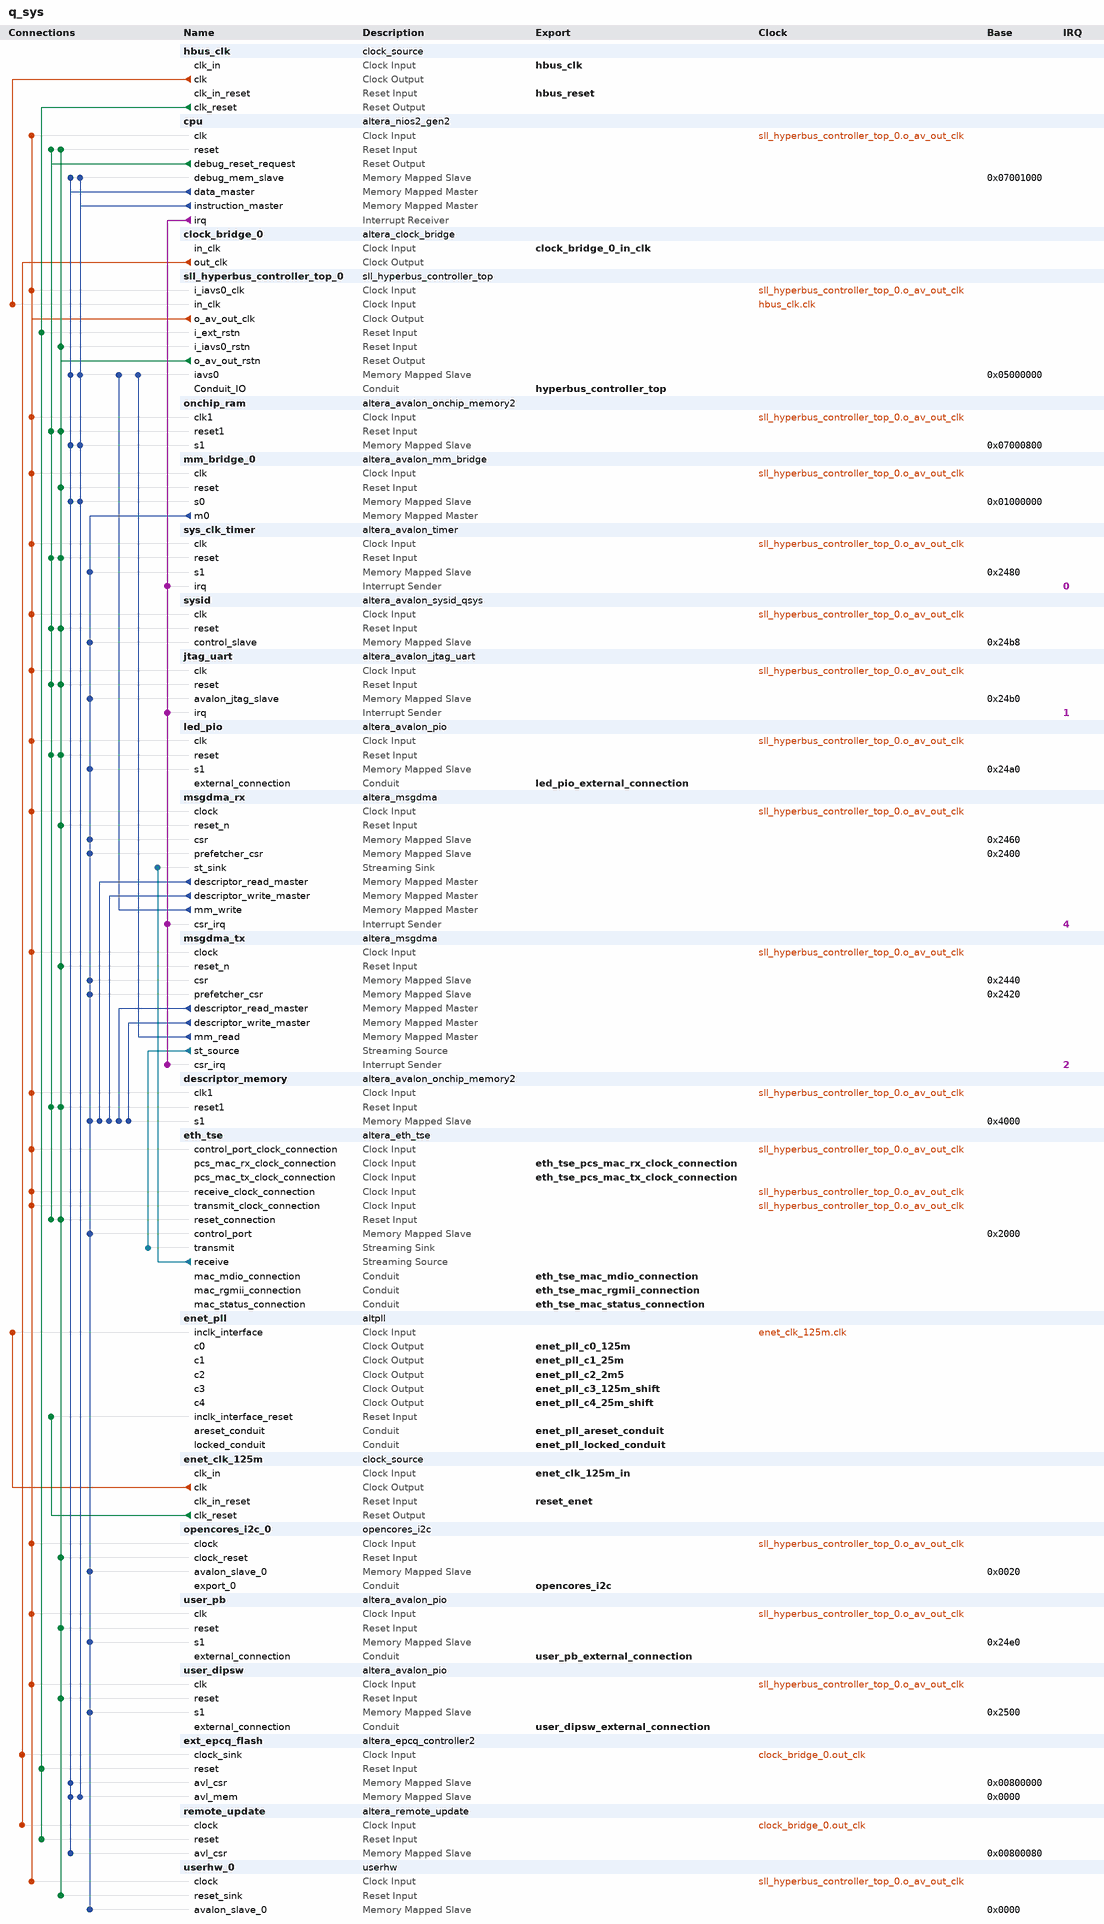
[diagram p0: system contents]
# Platform Designer (Qsys) system q_sys, Cyclone 10 LP 10CL025YU256I7G
# Parameters at their usual value, and those the tool derives, are not listed.
package require -exact qsys 18.1
create_system q_sys
set_project_property DEVICE_FAMILY {Cyclone 10 LP}
set_project_property DEVICE 10CL025YU256I7G

add_instance hbus_clk clock_source 18.1
set_instance_parameter_value hbus_clk clockFrequency 50000000

add_instance cpu altera_nios2_gen2 18.1
set_instance_parameter_value cpu dcache_bursts true
set_instance_parameter_value cpu dcache_size 4096
set_instance_parameter_value cpu exceptionOffset 288
set_instance_parameter_value cpu exceptionSlave sll_hyperbus_controller_top_0.iavs0
set_instance_parameter_value cpu icache_burstType Sequential
set_instance_parameter_value cpu icache_size 4096
set_instance_parameter_value cpu impl Fast
set_instance_parameter_value cpu mul_32_impl 3
set_instance_parameter_value cpu resetOffset 3145728
set_instance_parameter_value cpu resetSlave ext_epcq_flash.avl_mem
set_instance_parameter_value cpu setting_activateTrace true
set_instance_parameter_value cpu shift_rot_impl 0

add_instance clock_bridge_0 altera_clock_bridge 18.1
set_instance_parameter_value clock_bridge_0 DERIVED_CLOCK_RATE 0
set_instance_parameter_value clock_bridge_0 EXPLICIT_CLOCK_RATE 0

add_instance sll_hyperbus_controller_top_0 sll_hyperbus_controller_top 3.1.0
set_instance_parameter_value sll_hyperbus_controller_top_0 GUI_DEV0_BURST_LENGTH_MAN 3
set_instance_parameter_value sll_hyperbus_controller_top_0 GUI_DEV0_DRIVE_STRENGTH_MAN 0
set_instance_parameter_value sll_hyperbus_controller_top_0 GUI_DEV0_FIXED_LATENCY_MAN 1
set_instance_parameter_value sll_hyperbus_controller_top_0 GUI_DEV0_INIT_LATENCY_MAN 6
set_instance_parameter_value sll_hyperbus_controller_top_0 GUI_DEV0_TYPE_MAN none
set_instance_parameter_value sll_hyperbus_controller_top_0 GUI_DEV0_USE_DEFAULT true
set_instance_parameter_value sll_hyperbus_controller_top_0 GUI_DEV1_BURST_LENGTH_MAN 3
set_instance_parameter_value sll_hyperbus_controller_top_0 GUI_DEV1_DRIVE_STRENGTH_MAN 0
set_instance_parameter_value sll_hyperbus_controller_top_0 GUI_DEV1_FIXED_LATENCY_MAN 1
set_instance_parameter_value sll_hyperbus_controller_top_0 GUI_DEV1_INIT_LATENCY_MAN 6
set_instance_parameter_value sll_hyperbus_controller_top_0 GUI_DEV1_TYPE_MAN none
set_instance_parameter_value sll_hyperbus_controller_top_0 GUI_DEV1_USE_DEFAULT true
set_instance_parameter_value sll_hyperbus_controller_top_0 GUI_DQIN_MODE 8
set_instance_parameter_value sll_hyperbus_controller_top_0 GUI_DUAL_RWDS_PIN false
set_instance_parameter_value sll_hyperbus_controller_top_0 GUI_FPGA_DEV_BOARD alt_c10_dev2
set_instance_parameter_value sll_hyperbus_controller_top_0 GUI_IAVS0_ADDR_UNITS Words
set_instance_parameter_value sll_hyperbus_controller_top_0 GUI_IAVS0_BURST_ON_BURST_BOUNDARIES_ONLY false
set_instance_parameter_value sll_hyperbus_controller_top_0 GUI_IAVS0_BYTEENABLE true
set_instance_parameter_value sll_hyperbus_controller_top_0 GUI_IAVS0_DATA_WIDTH 32
set_instance_parameter_value sll_hyperbus_controller_top_0 GUI_IAVS0_LINEWRAP_BURST true
set_instance_parameter_value sll_hyperbus_controller_top_0 GUI_IAVS0_MAX_BURST_IN_WORDS 8
set_instance_parameter_value sll_hyperbus_controller_top_0 GUI_IAVS0_REG_RDATA false
set_instance_parameter_value sll_hyperbus_controller_top_0 GUI_IAVS0_REG_WDATA false
set_instance_parameter_value sll_hyperbus_controller_top_0 GUI_IAVS0_USE_RESPONSE false
set_instance_parameter_value sll_hyperbus_controller_top_0 GUI_IAVS0_WRITE_MODE true
set_instance_parameter_value sll_hyperbus_controller_top_0 GUI_INCLUDE_REG_AVALON 0
set_instance_parameter_value sll_hyperbus_controller_top_0 GUI_INPUT_FREQ_IN_MHZ_SC 50
set_instance_parameter_value sll_hyperbus_controller_top_0 GUI_INTEGRATED_PLL_ENABLED 1
set_instance_parameter_value sll_hyperbus_controller_top_0 GUI_SINGLE_CLK_OP false
set_instance_parameter_value sll_hyperbus_controller_top_0 HYPERBUS_FREQ_IN_MHZ 150
set_instance_parameter_value sll_hyperbus_controller_top_0 IAVS_FREQ_OUT_IN_MHZ 75
set_instance_parameter_value sll_hyperbus_controller_top_0 NUM_CHIPSELECTS 2

add_instance onchip_ram altera_avalon_onchip_memory2 18.1
set_instance_parameter_value onchip_ram dataWidth 32
set_instance_parameter_value onchip_ram dualPort false
set_instance_parameter_value onchip_ram initMemContent true
set_instance_parameter_value onchip_ram initializationFileName onchip_mem.hex
set_instance_parameter_value onchip_ram memorySize 2048

add_instance mm_bridge_0 altera_avalon_mm_bridge 18.1
set_instance_parameter_value mm_bridge_0 ADDRESS_UNITS SYMBOLS
set_instance_parameter_value mm_bridge_0 ADDRESS_WIDTH 10
set_instance_parameter_value mm_bridge_0 DATA_WIDTH 32
set_instance_parameter_value mm_bridge_0 MAX_PENDING_RESPONSES 4
set_instance_parameter_value mm_bridge_0 USE_AUTO_ADDRESS_WIDTH 1

add_instance sys_clk_timer altera_avalon_timer 18.1
set_instance_parameter_value sys_clk_timer period 10
set_instance_parameter_value sys_clk_timer periodUnits MSEC

add_instance sysid altera_avalon_sysid_qsys 18.1
set_instance_parameter_value sysid id -87110914

add_instance jtag_uart altera_avalon_jtag_uart 18.1
set_instance_parameter_value jtag_uart simInteractiveOptions INTERACTIVE_ASCII_OUTPUT

add_instance led_pio altera_avalon_pio 18.1
set_instance_parameter_value led_pio direction Output
set_instance_parameter_value led_pio resetValue 15
set_instance_parameter_value led_pio width 4

add_instance msgdma_rx altera_msgdma 18.1
set_instance_parameter_value msgdma_rx BURST_ENABLE 0
set_instance_parameter_value msgdma_rx DATA_FIFO_DEPTH 64
set_instance_parameter_value msgdma_rx DATA_WIDTH 32
set_instance_parameter_value msgdma_rx DESCRIPTOR_FIFO_DEPTH 128
set_instance_parameter_value msgdma_rx ENHANCED_FEATURES 0
set_instance_parameter_value msgdma_rx ERROR_ENABLE 1
set_instance_parameter_value msgdma_rx ERROR_WIDTH 6
set_instance_parameter_value msgdma_rx MAX_BURST_COUNT 8
set_instance_parameter_value msgdma_rx MAX_BYTE 524288
set_instance_parameter_value msgdma_rx MODE 2
set_instance_parameter_value msgdma_rx PACKET_ENABLE 1
set_instance_parameter_value msgdma_rx PREFETCHER_ENABLE 1
set_instance_parameter_value msgdma_rx TRANSFER_TYPE {Aligned Accesses}

add_instance msgdma_tx altera_msgdma 18.1
set_instance_parameter_value msgdma_tx BURST_ENABLE 0
set_instance_parameter_value msgdma_tx DATA_FIFO_DEPTH 128
set_instance_parameter_value msgdma_tx DATA_WIDTH 32
set_instance_parameter_value msgdma_tx DESCRIPTOR_FIFO_DEPTH 128
set_instance_parameter_value msgdma_tx ENHANCED_FEATURES 0
set_instance_parameter_value msgdma_tx ERROR_ENABLE 1
set_instance_parameter_value msgdma_tx ERROR_WIDTH 1
set_instance_parameter_value msgdma_tx MAX_BURST_COUNT 8
set_instance_parameter_value msgdma_tx MAX_BYTE 262144
set_instance_parameter_value msgdma_tx MODE 1
set_instance_parameter_value msgdma_tx PACKET_ENABLE 1
set_instance_parameter_value msgdma_tx PREFETCHER_ENABLE 1
set_instance_parameter_value msgdma_tx TRANSFER_TYPE {Aligned Accesses}

add_instance descriptor_memory altera_avalon_onchip_memory2 18.1
set_instance_parameter_value descriptor_memory dataWidth 32
set_instance_parameter_value descriptor_memory dualPort false
set_instance_parameter_value descriptor_memory initMemContent true
set_instance_parameter_value descriptor_memory initializationFileName descriptor_memory
set_instance_parameter_value descriptor_memory memorySize 8192

add_instance eth_tse altera_eth_tse 18.1
set_instance_parameter_value eth_tse XCVR_RCFG_JTAG_ENABLE 0
set_instance_parameter_value eth_tse XCVR_SET_CAPABILITY_REG_ENABLE 0
set_instance_parameter_value eth_tse XCVR_SET_CSR_SOFT_LOGIC_ENABLE 0
set_instance_parameter_value eth_tse XCVR_SET_PRBS_SOFT_LOGIC_ENABLE 0
set_instance_parameter_value eth_tse XCVR_SET_USER_IDENTIFIER 0
set_instance_parameter_value eth_tse core_variation MAC_ONLY
set_instance_parameter_value eth_tse eg_addr 9
set_instance_parameter_value eth_tse enable_hd_logic false
set_instance_parameter_value eth_tse enable_mac_flow_ctrl false
set_instance_parameter_value eth_tse enable_magic_detect true
set_instance_parameter_value eth_tse enable_sgmii true
set_instance_parameter_value eth_tse enable_shift16 true
set_instance_parameter_value eth_tse ifGMII RGMII
set_instance_parameter_value eth_tse ing_addr 10
set_instance_parameter_value eth_tse mdio_clk_div 40
set_instance_parameter_value eth_tse nf_phyip_rcfg_enable true
set_instance_parameter_value eth_tse stat_cnt_ena true
set_instance_parameter_value eth_tse transceiver_type NONE

add_instance enet_pll altpll 18.1
set_instance_parameter_value enet_pll CLK0_DIVIDE_BY 1
set_instance_parameter_value enet_pll CLK0_MULTIPLY_BY 1
set_instance_parameter_value enet_pll CLK1_DIVIDE_BY 5
set_instance_parameter_value enet_pll CLK1_DUTY_CYCLE 50
set_instance_parameter_value enet_pll CLK1_MULTIPLY_BY 1
set_instance_parameter_value enet_pll CLK1_PHASE_SHIFT 0
set_instance_parameter_value enet_pll CLK2_DIVIDE_BY 50
set_instance_parameter_value enet_pll CLK2_DUTY_CYCLE 50
set_instance_parameter_value enet_pll CLK2_MULTIPLY_BY 1
set_instance_parameter_value enet_pll CLK2_PHASE_SHIFT 0
set_instance_parameter_value enet_pll CLK3_DIVIDE_BY 1
set_instance_parameter_value enet_pll CLK3_DUTY_CYCLE 50
set_instance_parameter_value enet_pll CLK3_MULTIPLY_BY 1
set_instance_parameter_value enet_pll CLK3_PHASE_SHIFT 2000
set_instance_parameter_value enet_pll CLK4_DIVIDE_BY 5
set_instance_parameter_value enet_pll CLK4_DUTY_CYCLE 50
set_instance_parameter_value enet_pll CLK4_MULTIPLY_BY 1
set_instance_parameter_value enet_pll CLK4_PHASE_SHIFT 10000
set_instance_parameter_value enet_pll INCLK0_INPUT_FREQUENCY 8000
set_instance_parameter_value enet_pll PORT_ARESET PORT_USED
set_instance_parameter_value enet_pll PORT_LOCKED PORT_USED
set_instance_parameter_value enet_pll PORT_clk1 PORT_USED
set_instance_parameter_value enet_pll PORT_clk2 PORT_USED
set_instance_parameter_value enet_pll PORT_clk3 PORT_USED
set_instance_parameter_value enet_pll PORT_clk4 PORT_USED

add_instance enet_clk_125m clock_source 18.1
set_instance_parameter_value enet_clk_125m clockFrequency 125000000

add_instance opencores_i2c_0 opencores_i2c 9.1
set_instance_parameter_value opencores_i2c_0 CLOCK_RATE 75000000

add_instance user_pb altera_avalon_pio 18.1
set_instance_parameter_value user_pb direction Input
set_instance_parameter_value user_pb width 4

add_instance user_dipsw altera_avalon_pio 18.1
set_instance_parameter_value user_dipsw direction Input
set_instance_parameter_value user_dipsw width 4

add_instance ext_epcq_flash altera_epcq_controller2 18.1
set_instance_parameter_value ext_epcq_flash CHIP_SELS 1
set_instance_parameter_value ext_epcq_flash DDASI 0
set_instance_parameter_value ext_epcq_flash FLASH_TYPE EPCQ64
set_instance_parameter_value ext_epcq_flash IO_MODE STANDARD
set_instance_parameter_value ext_epcq_flash clkFreq 0

add_instance remote_update altera_remote_update 18.1
set_instance_parameter_value remote_update CBX_AUTO_BLACKBOX ALL
set_instance_parameter_value remote_update DEVICE 10CL025YU256I7G
set_instance_parameter_value remote_update GUI_config_device EPCQ64
set_instance_parameter_value remote_update check_app_pof false
set_instance_parameter_value remote_update check_avalon_interface true
set_instance_parameter_value remote_update m_support_write_config_check true
set_instance_parameter_value remote_update operation_mode REMOTE

add_instance userhw_0 userhw 1.0

# connections
add_connection clock_bridge_0.out_clk ext_epcq_flash.clock_sink clock
add_connection clock_bridge_0.out_clk remote_update.clock clock
add_connection enet_clk_125m.clk enet_pll.inclk_interface clock
add_connection hbus_clk.clk sll_hyperbus_controller_top_0.in_clk clock
add_connection sll_hyperbus_controller_top_0.o_av_out_clk cpu.clk clock
add_connection sll_hyperbus_controller_top_0.o_av_out_clk descriptor_memory.clk1 clock
add_connection sll_hyperbus_controller_top_0.o_av_out_clk eth_tse.control_port_clock_connection clock
add_connection sll_hyperbus_controller_top_0.o_av_out_clk eth_tse.receive_clock_connection clock
add_connection sll_hyperbus_controller_top_0.o_av_out_clk eth_tse.transmit_clock_connection clock
add_connection sll_hyperbus_controller_top_0.o_av_out_clk jtag_uart.clk clock
add_connection sll_hyperbus_controller_top_0.o_av_out_clk led_pio.clk clock
add_connection sll_hyperbus_controller_top_0.o_av_out_clk mm_bridge_0.clk clock
add_connection sll_hyperbus_controller_top_0.o_av_out_clk msgdma_rx.clock clock
add_connection sll_hyperbus_controller_top_0.o_av_out_clk msgdma_tx.clock clock
add_connection sll_hyperbus_controller_top_0.o_av_out_clk onchip_ram.clk1 clock
add_connection sll_hyperbus_controller_top_0.o_av_out_clk opencores_i2c_0.clock clock
add_connection sll_hyperbus_controller_top_0.o_av_out_clk sll_hyperbus_controller_top_0.i_iavs0_clk clock
add_connection sll_hyperbus_controller_top_0.o_av_out_clk sys_clk_timer.clk clock
add_connection sll_hyperbus_controller_top_0.o_av_out_clk sysid.clk clock
add_connection sll_hyperbus_controller_top_0.o_av_out_clk user_dipsw.clk clock
add_connection sll_hyperbus_controller_top_0.o_av_out_clk user_pb.clk clock
add_connection sll_hyperbus_controller_top_0.o_av_out_clk userhw_0.clock clock
add_connection cpu.debug_reset_request cpu.reset reset
add_connection cpu.debug_reset_request descriptor_memory.reset1 reset
add_connection cpu.debug_reset_request eth_tse.reset_connection reset
add_connection cpu.debug_reset_request jtag_uart.reset reset
add_connection cpu.debug_reset_request led_pio.reset reset
add_connection cpu.debug_reset_request onchip_ram.reset1 reset
add_connection cpu.debug_reset_request sys_clk_timer.reset reset
add_connection cpu.debug_reset_request sysid.reset reset
add_connection enet_clk_125m.clk_reset enet_pll.inclk_interface_reset reset
add_connection hbus_clk.clk_reset ext_epcq_flash.reset reset
add_connection hbus_clk.clk_reset remote_update.reset reset
add_connection hbus_clk.clk_reset sll_hyperbus_controller_top_0.i_ext_rstn reset
add_connection sll_hyperbus_controller_top_0.o_av_out_rstn cpu.reset reset
add_connection sll_hyperbus_controller_top_0.o_av_out_rstn descriptor_memory.reset1 reset
add_connection sll_hyperbus_controller_top_0.o_av_out_rstn eth_tse.reset_connection reset
add_connection sll_hyperbus_controller_top_0.o_av_out_rstn jtag_uart.reset reset
add_connection sll_hyperbus_controller_top_0.o_av_out_rstn led_pio.reset reset
add_connection sll_hyperbus_controller_top_0.o_av_out_rstn mm_bridge_0.reset reset
add_connection sll_hyperbus_controller_top_0.o_av_out_rstn msgdma_rx.reset_n reset
add_connection sll_hyperbus_controller_top_0.o_av_out_rstn msgdma_tx.reset_n reset
add_connection sll_hyperbus_controller_top_0.o_av_out_rstn onchip_ram.reset1 reset
add_connection sll_hyperbus_controller_top_0.o_av_out_rstn opencores_i2c_0.clock_reset reset
add_connection sll_hyperbus_controller_top_0.o_av_out_rstn sll_hyperbus_controller_top_0.i_iavs0_rstn reset
add_connection sll_hyperbus_controller_top_0.o_av_out_rstn sys_clk_timer.reset reset
add_connection sll_hyperbus_controller_top_0.o_av_out_rstn sysid.reset reset
add_connection sll_hyperbus_controller_top_0.o_av_out_rstn user_dipsw.reset reset
add_connection sll_hyperbus_controller_top_0.o_av_out_rstn user_pb.reset reset
add_connection sll_hyperbus_controller_top_0.o_av_out_rstn userhw_0.reset_sink reset
add_connection cpu.data_master cpu.debug_mem_slave avalon
set_connection_parameter_value cpu.data_master/cpu.debug_mem_slave baseAddress 0x07001000
add_connection cpu.data_master ext_epcq_flash.avl_csr avalon
set_connection_parameter_value cpu.data_master/ext_epcq_flash.avl_csr baseAddress 0x00800000
add_connection cpu.data_master ext_epcq_flash.avl_mem avalon
set_connection_parameter_value cpu.data_master/ext_epcq_flash.avl_mem baseAddress 0x0000
add_connection cpu.data_master mm_bridge_0.s0 avalon
set_connection_parameter_value cpu.data_master/mm_bridge_0.s0 baseAddress 0x01000000
add_connection cpu.data_master onchip_ram.s1 avalon
set_connection_parameter_value cpu.data_master/onchip_ram.s1 baseAddress 0x07000800
add_connection cpu.data_master remote_update.avl_csr avalon
set_connection_parameter_value cpu.data_master/remote_update.avl_csr baseAddress 0x00800080
add_connection cpu.data_master sll_hyperbus_controller_top_0.iavs0 avalon
set_connection_parameter_value cpu.data_master/sll_hyperbus_controller_top_0.iavs0 baseAddress 0x05000000
add_connection cpu.instruction_master cpu.debug_mem_slave avalon
set_connection_parameter_value cpu.instruction_master/cpu.debug_mem_slave baseAddress 0x07001000
add_connection cpu.instruction_master ext_epcq_flash.avl_mem avalon
set_connection_parameter_value cpu.instruction_master/ext_epcq_flash.avl_mem baseAddress 0x0000
add_connection cpu.instruction_master mm_bridge_0.s0 avalon
set_connection_parameter_value cpu.instruction_master/mm_bridge_0.s0 baseAddress 0x01000000
add_connection cpu.instruction_master onchip_ram.s1 avalon
set_connection_parameter_value cpu.instruction_master/onchip_ram.s1 baseAddress 0x07000800
add_connection cpu.instruction_master sll_hyperbus_controller_top_0.iavs0 avalon
set_connection_parameter_value cpu.instruction_master/sll_hyperbus_controller_top_0.iavs0 baseAddress 0x05000000
add_connection mm_bridge_0.m0 descriptor_memory.s1 avalon
set_connection_parameter_value mm_bridge_0.m0/descriptor_memory.s1 baseAddress 0x4000
add_connection mm_bridge_0.m0 eth_tse.control_port avalon
set_connection_parameter_value mm_bridge_0.m0/eth_tse.control_port baseAddress 0x2000
add_connection mm_bridge_0.m0 jtag_uart.avalon_jtag_slave avalon
set_connection_parameter_value mm_bridge_0.m0/jtag_uart.avalon_jtag_slave baseAddress 0x24b0
add_connection mm_bridge_0.m0 led_pio.s1 avalon
set_connection_parameter_value mm_bridge_0.m0/led_pio.s1 baseAddress 0x24a0
add_connection mm_bridge_0.m0 msgdma_rx.csr avalon
set_connection_parameter_value mm_bridge_0.m0/msgdma_rx.csr baseAddress 0x2460
add_connection mm_bridge_0.m0 msgdma_rx.prefetcher_csr avalon
set_connection_parameter_value mm_bridge_0.m0/msgdma_rx.prefetcher_csr baseAddress 0x2400
add_connection mm_bridge_0.m0 msgdma_tx.csr avalon
set_connection_parameter_value mm_bridge_0.m0/msgdma_tx.csr baseAddress 0x2440
add_connection mm_bridge_0.m0 msgdma_tx.prefetcher_csr avalon
set_connection_parameter_value mm_bridge_0.m0/msgdma_tx.prefetcher_csr baseAddress 0x2420
add_connection mm_bridge_0.m0 opencores_i2c_0.avalon_slave_0 avalon
set_connection_parameter_value mm_bridge_0.m0/opencores_i2c_0.avalon_slave_0 baseAddress 0x0020
add_connection mm_bridge_0.m0 sys_clk_timer.s1 avalon
set_connection_parameter_value mm_bridge_0.m0/sys_clk_timer.s1 baseAddress 0x2480
add_connection mm_bridge_0.m0 sysid.control_slave avalon
set_connection_parameter_value mm_bridge_0.m0/sysid.control_slave baseAddress 0x24b8
add_connection mm_bridge_0.m0 user_dipsw.s1 avalon
set_connection_parameter_value mm_bridge_0.m0/user_dipsw.s1 baseAddress 0x2500
add_connection mm_bridge_0.m0 user_pb.s1 avalon
set_connection_parameter_value mm_bridge_0.m0/user_pb.s1 baseAddress 0x24e0
add_connection mm_bridge_0.m0 userhw_0.avalon_slave_0 avalon
set_connection_parameter_value mm_bridge_0.m0/userhw_0.avalon_slave_0 baseAddress 0x0000
add_connection msgdma_rx.descriptor_read_master descriptor_memory.s1 avalon
set_connection_parameter_value msgdma_rx.descriptor_read_master/descriptor_memory.s1 baseAddress 0x4000
add_connection msgdma_rx.descriptor_write_master descriptor_memory.s1 avalon
set_connection_parameter_value msgdma_rx.descriptor_write_master/descriptor_memory.s1 baseAddress 0x4000
add_connection msgdma_rx.mm_write sll_hyperbus_controller_top_0.iavs0 avalon
set_connection_parameter_value msgdma_rx.mm_write/sll_hyperbus_controller_top_0.iavs0 baseAddress 0x05000000
add_connection msgdma_tx.descriptor_read_master descriptor_memory.s1 avalon
set_connection_parameter_value msgdma_tx.descriptor_read_master/descriptor_memory.s1 baseAddress 0x4000
add_connection msgdma_tx.descriptor_write_master descriptor_memory.s1 avalon
set_connection_parameter_value msgdma_tx.descriptor_write_master/descriptor_memory.s1 baseAddress 0x4000
add_connection msgdma_tx.mm_read sll_hyperbus_controller_top_0.iavs0 avalon
set_connection_parameter_value msgdma_tx.mm_read/sll_hyperbus_controller_top_0.iavs0 baseAddress 0x05000000
add_connection eth_tse.receive msgdma_rx.st_sink avalon_streaming
add_connection msgdma_tx.st_source eth_tse.transmit avalon_streaming
add_connection cpu.irq jtag_uart.irq interrupt
set_connection_parameter_value cpu.irq/jtag_uart.irq irqNumber 1
add_connection cpu.irq msgdma_rx.csr_irq interrupt
set_connection_parameter_value cpu.irq/msgdma_rx.csr_irq irqNumber 4
add_connection cpu.irq msgdma_tx.csr_irq interrupt
set_connection_parameter_value cpu.irq/msgdma_tx.csr_irq irqNumber 2
add_connection cpu.irq sys_clk_timer.irq interrupt
set_connection_parameter_value cpu.irq/sys_clk_timer.irq irqNumber 0

# exported interfaces
add_interface clock_bridge_0_in_clk clock sink
set_interface_property clock_bridge_0_in_clk EXPORT_OF clock_bridge_0.in_clk
add_interface enet_clk_125m_in clock sink
set_interface_property enet_clk_125m_in EXPORT_OF enet_clk_125m.clk_in
add_interface enet_pll_areset_conduit conduit end
set_interface_property enet_pll_areset_conduit EXPORT_OF enet_pll.areset_conduit
add_interface enet_pll_c0_125m clock source
set_interface_property enet_pll_c0_125m EXPORT_OF enet_pll.c0
add_interface enet_pll_c1_25m clock source
set_interface_property enet_pll_c1_25m EXPORT_OF enet_pll.c1
add_interface enet_pll_c2_2m5 clock source
set_interface_property enet_pll_c2_2m5 EXPORT_OF enet_pll.c2
add_interface enet_pll_c3_125m_shift clock source
set_interface_property enet_pll_c3_125m_shift EXPORT_OF enet_pll.c3
add_interface enet_pll_c4_25m_shift clock source
set_interface_property enet_pll_c4_25m_shift EXPORT_OF enet_pll.c4
add_interface enet_pll_locked_conduit conduit end
set_interface_property enet_pll_locked_conduit EXPORT_OF enet_pll.locked_conduit
add_interface eth_tse_mac_mdio_connection conduit end
set_interface_property eth_tse_mac_mdio_connection EXPORT_OF eth_tse.mac_mdio_connection
add_interface eth_tse_mac_rgmii_connection conduit end
set_interface_property eth_tse_mac_rgmii_connection EXPORT_OF eth_tse.mac_rgmii_connection
add_interface eth_tse_mac_status_connection conduit end
set_interface_property eth_tse_mac_status_connection EXPORT_OF eth_tse.mac_status_connection
add_interface eth_tse_pcs_mac_rx_clock_connection clock sink
set_interface_property eth_tse_pcs_mac_rx_clock_connection EXPORT_OF eth_tse.pcs_mac_rx_clock_connection
add_interface eth_tse_pcs_mac_tx_clock_connection clock sink
set_interface_property eth_tse_pcs_mac_tx_clock_connection EXPORT_OF eth_tse.pcs_mac_tx_clock_connection
add_interface hbus_clk clock sink
set_interface_property hbus_clk EXPORT_OF hbus_clk.clk_in
add_interface hbus_reset reset sink
set_interface_property hbus_reset EXPORT_OF hbus_clk.clk_in_reset
add_interface hyperbus_controller_top conduit end
set_interface_property hyperbus_controller_top EXPORT_OF sll_hyperbus_controller_top_0.Conduit_IO
add_interface led_pio_external_connection conduit end
set_interface_property led_pio_external_connection EXPORT_OF led_pio.external_connection
add_interface opencores_i2c conduit end
set_interface_property opencores_i2c EXPORT_OF opencores_i2c_0.export_0
add_interface reset_enet reset sink
set_interface_property reset_enet EXPORT_OF enet_clk_125m.clk_in_reset
add_interface user_dipsw_external_connection conduit end
set_interface_property user_dipsw_external_connection EXPORT_OF user_dipsw.external_connection
add_interface user_pb_external_connection conduit end
set_interface_property user_pb_external_connection EXPORT_OF user_pb.external_connection

set_interconnect_requirement {$system} qsys_mm.clockCrossingAdapter HANDSHAKE
set_interconnect_requirement {$system} qsys_mm.maxAdditionalLatency 0
set_interconnect_requirement {mm_interconnect_0|cmd_mux_004.src/sll_hyperbus_controller_top_0_iavs0_burst_adapter.sink0} qsys_mm.postTransform.pipelineCount 0

save_system q_sys.qsys
